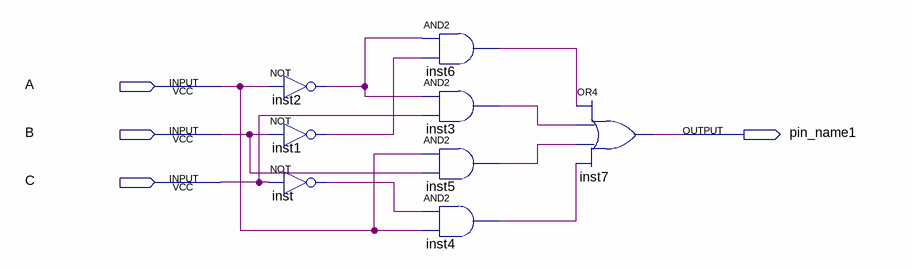
[diagram p0: schematic sheet]
// Quartus schematic lab2step2.bdf as structural Verilog: 8 symbols, 4 pins
module lab2step2 (
  input  A,
  input  B,
  input  C,
  output pin_name1
);

  wire inst1_out, inst2_out, inst3_out, inst4_out, inst5_out, inst6_out, inst_out;

  not inst2 (inst2_out, A);
  not inst1 (inst1_out, B);
  not inst (inst_out, C);
  and inst6 (inst6_out, inst2_out, inst1_out);
  and inst3 (inst3_out, inst2_out, C);
  and inst5 (inst5_out, A, B);
  and inst4 (inst4_out, inst_out, A);
  or inst7 (pin_name1, inst6_out, inst3_out, inst5_out, inst4_out);
endmodule
